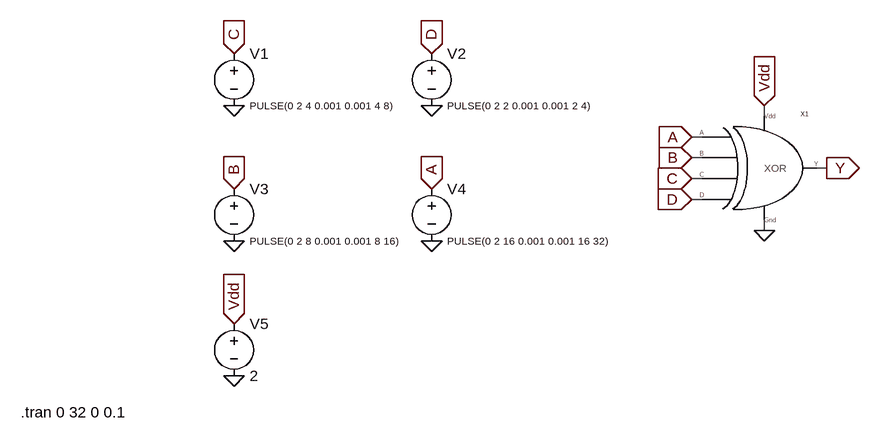
[diagram p0: schematic 4xor symbol.asc]
4xor symbol.asc, the LTspice schematic file:
Version 4
SHEET 1 880 680
WIRE 624 -32 624 -48
WIRE 528 0 512 0
WIRE 528 32 512 32
WIRE 720 48 704 48
WIRE 528 64 512 64
WIRE 528 96 512 96
WIRE 624 144 624 128
FLAG -192 288 Vdd
IOPIN -192 288 In
FLAG 112 -128 D
IOPIN 112 -128 In
FLAG -192 -128 C
IOPIN -192 -128 In
FLAG -192 80 B
IOPIN -192 80 In
FLAG -192 368 0
FLAG 112 160 0
FLAG -192 160 0
FLAG -192 -48 0
FLAG 112 -48 0
FLAG 112 80 A
IOPIN 112 80 In
FLAG 512 0 A
IOPIN 512 0 In
FLAG 512 32 B
IOPIN 512 32 In
FLAG 512 64 C
IOPIN 512 64 In
FLAG 512 96 D
IOPIN 512 96 In
FLAG 624 -48 Vdd
IOPIN 624 -48 In
FLAG 624 144 0
FLAG 720 48 Y
IOPIN 720 48 Out
SYMBOL voltage -192 -144 R0
WINDOW 3 24 96 Left 1
WINDOW 123 0 0 Left 0
WINDOW 39 0 0 Left 0
SYMATTR Value PULSE(0 2 4 0.001 0.001 4 8)
SYMATTR InstName V1
SYMBOL voltage 112 -144 R0
WINDOW 3 24 96 Left 1
WINDOW 123 0 0 Left 0
WINDOW 39 0 0 Left 0
SYMATTR Value PULSE(0 2 2 0.001 0.001 2 4)
SYMATTR InstName V2
SYMBOL voltage -192 64 R0
WINDOW 3 24 96 Left 1
WINDOW 123 0 0 Left 0
WINDOW 39 0 0 Left 0
SYMATTR Value PULSE(0 2 8 0.001 0.001 8 16)
SYMATTR InstName V3
SYMBOL voltage 112 64 R0
WINDOW 3 24 96 Left 1
WINDOW 123 0 0 Left 0
WINDOW 39 0 0 Left 0
SYMATTR Value PULSE(0 2 16 0.001 0.001 16 32)
SYMATTR InstName V4
SYMBOL voltage -192 272 R0
WINDOW 123 0 0 Left 0
WINDOW 39 0 0 Left 0
SYMATTR InstName V5
SYMATTR Value 2
SYMBOL 4xor 512 32 R0
SYMATTR InstName X1
TEXT -520 424 Left 2 !.tran 0 32 0 0.1

The netlist it stands for:
* 4xor symbol.asc
V1 C 0 PULSE(0 2 4 0.001 0.001 4 8)
V2 D 0 PULSE(0 2 2 0.001 0.001 2 4)
V3 B 0 PULSE(0 2 8 0.001 0.001 8 16)
V4 A 0 PULSE(0 2 16 0.001 0.001 16 32)
V5 Vdd 0 2
XX1 Vdd 0 A B C D Y 4xor  ; pins Vdd Gnd A B C D Y
.tran 0 32 0 0.1
.backanno
.end

* Results of the author's LTspice run, read from the files saved beside the schematic
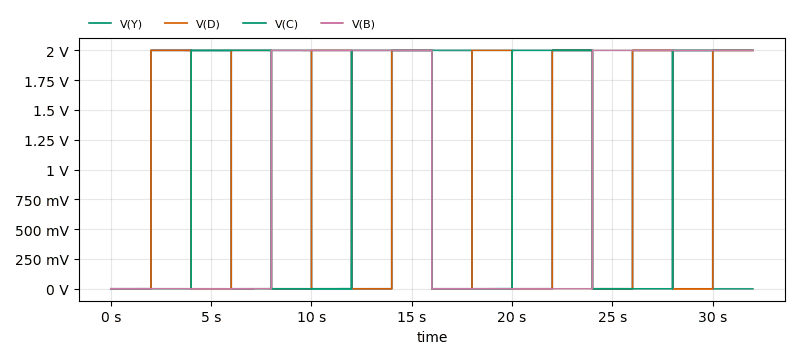
[diagram p1: Transient Analysis of 4xor symbol.asc, plotted from the saved traces]
* Transient Analysis, 1 run:
*   V(Y): min 401 nV, max 2 V, average 1 V, rms 1.414 V, last 401 nV
*   V(D): min 0 V, max 2 V, average 1 V, rms 1.414 V, last 2 V
*   V(C): min 0 V, max 2 V, average 1 V, rms 1.414 V, last 2 V
*   V(B): min 0 V, max 2 V, average 1 V, rms 1.414 V, last 2 V